# Altium project PCB_Project1.PrjPCB
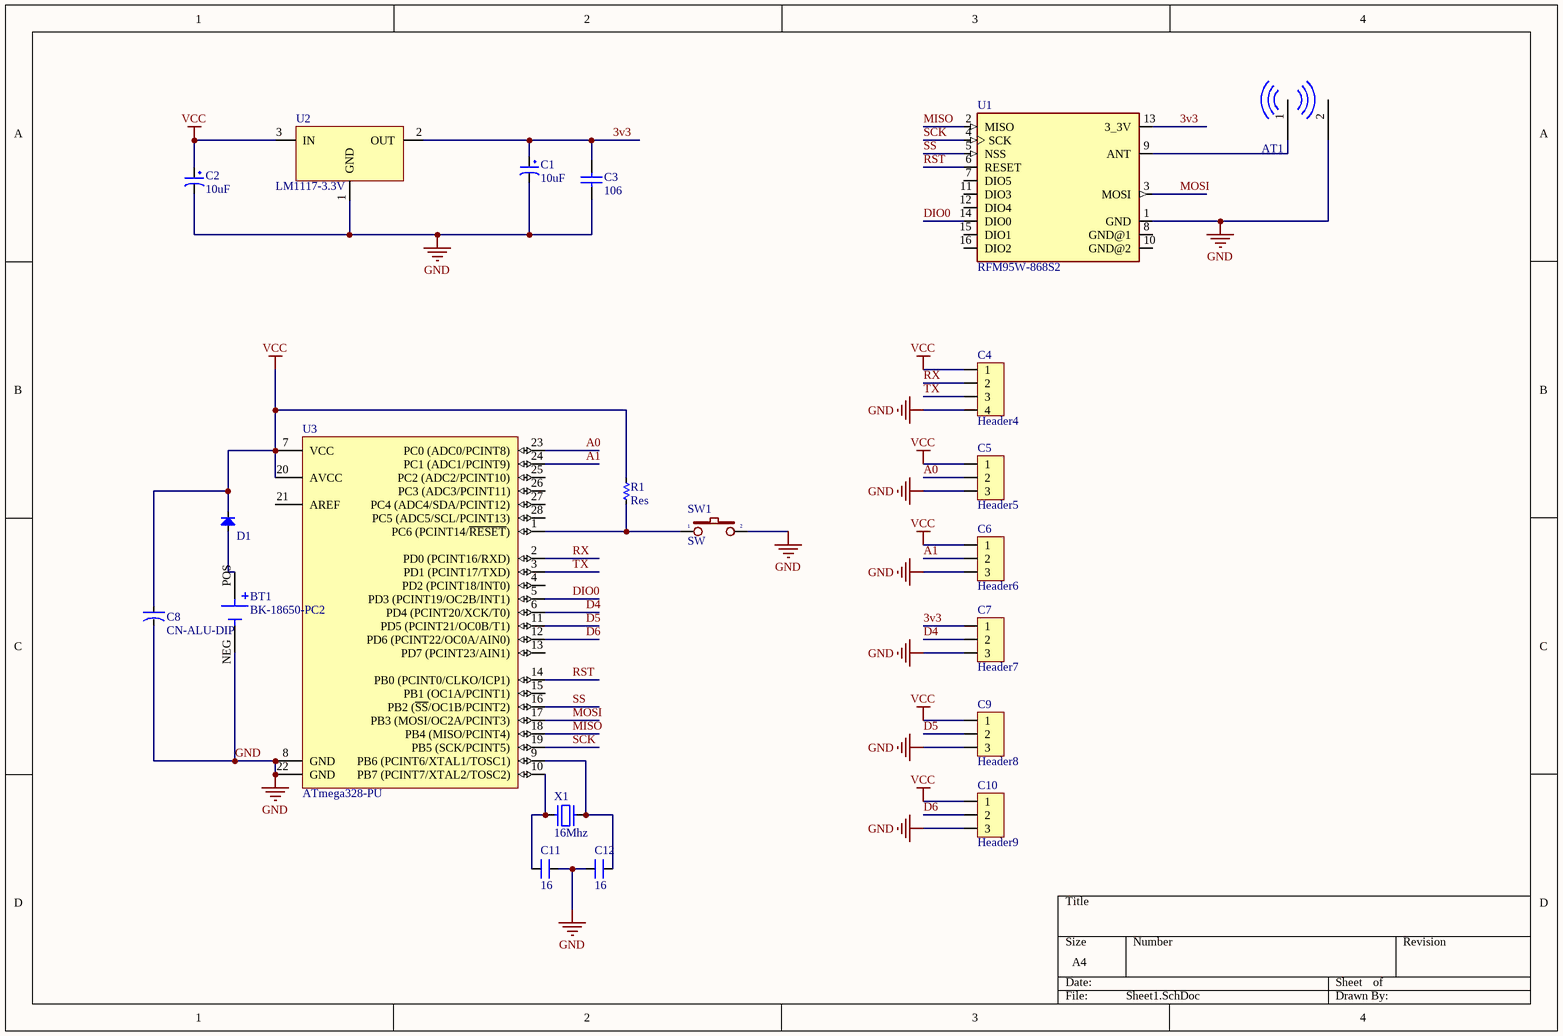
[diagram p0: Sheet1.SchDoc]
1 sheet, 21 parts. Net scope: global (net labels, ports and power ports of the same name join across sheets).
Board files: PCB1.PcbDoc, PCB2.PcbDoc

## Sheet Sheet1.SchDoc
size A4

### Parts
AT1  IPEX_CON  [U.FL/UMCC]  (value not drawn)
BT1  BK-18650-PC2  [BAT_BK-18650-PC2]
C1  10uF  [tu hoa 4mm]
C2  10uF  [tu hoa 4mm]
C3  106  [Tu 0805]
C4  Header4  [HDR4]
C5  Header5  [HDR3]
C6  Header6  [HDR3]
C7  Header7  [HDR3]
C8  CN-ALU-DIP  [CA-ALU-10BL]
C9  Header8  [HDR3]
C10  Header9  [HDR3]
C11  16  [CN1.5]
C12  16  [CN1.5]
D1  Diode  [DIO-1A]  (value not drawn)
R1  Res  [RES-1/8W]
SW1  SW  [SW1-SMD]
U1  RFM95W-868S2  [XCVR_RFM95W-868S2]
U2  LM1117-3.3V  [SOT223]
U3  ATmega328-PU  [DIP28]
X1  16Mhz  [XTAL-RU49/4]

### Nets
GND: AT1.2 BT1.NEG C1.2 C2.2 C3.2 C4.4 C5.3 C6.3 C7.3 C8.2 C9.3 C10.3 C11.2 C12.1 SW1.2 U1.1(GND) U2.1(GND) U3.8(GND) U3.22(GND)
VCC: C2.1 C4.1 C5.1 C6.1 C8.1 C9.1 C10.1 D1.2(K) R1.1 U2.3(IN) U3.7(VCC) U3.20(AVCC)
3v3: C1.1 C3.1 C7.1 U1.13(3_3V) U2.2(OUT)
A0: C5.2 U3.23(PC0_(ADC0/PCINT8))
A1: C6.2 U3.24(PC1_(ADC1/PCINT9))
D4: C7.2 U3.6(PD4_(PCINT20/XCK/T0))
D5: C9.2 U3.11(PD5_(PCINT21/OC0B/T1))
D6: C10.2 U3.12(PD6_(PCINT22/OC0A/AIN0))
DIO0: U1.14(DIO0) U3.5(PD3_(PCINT19/OC2B/INT1))
MISO: U1.2(MISO) U3.18(PB4_(MISO/PCINT4))
MOSI: U1.3(MOSI) U3.17(PB3_(MOSI/OC2A/PCINT3))
RST: U1.6(RESET) U3.14(PB0_(PCINT0/CLKO/ICP1))
RX: C4.2 U3.2(PD0_(PCINT16/RXD))
SCK: U1.4(SCK) U3.19(PB5_(SCK/PCINT5))
SS: U1.5(NSS) U3.16(PB2_(~{SS}/OC1B/PCINT2))
TX: C4.3 U3.3(PD1_(PCINT17/TXD))
NetAT1_1: AT1.1(AT) U1.9(ANT)
NetBT1_POS: BT1.POS D1.1(A)
NetC11_1: C11.1 U3.10(PB7_(PCINT7/XTAL2/TOSC2)) X1.1
NetC12_2: C12.2 U3.9(PB6_(PCINT6/XTAL1/TOSC1)) X1.2
NetR1_2: R1.2 SW1.1 U3.1(PC6_(PCINT14/~{RESET}))

Not connected (* = marked no-connect by the designer): U1 7(DIO5) 8(GND@1) 10(GND@2) 11(DIO3) 12(DIO4) 15(DIO1) 16(DIO2); U3 4(PD2_(PCINT18/INT0)) 13(PD7_(PCINT23/AIN1)) 15(PB1_(OC1A/PCINT1)) 21(AREF) 25(PC2_(ADC2/PCINT10)) 26(PC3_(ADC3/PCINT11)) 27(PC4_(ADC4/SDA/PCINT12)) 28(PC5_(ADC5/SCL/PCINT13))

### Library data of the parts
AT1 = LTI-IPXSM66AL: IPEX CONNECTER ANTENNA GPS GSM; Solder: SMT; MPN: LTI-IPXSM66AL; Value: IPEX_CON
BT1 = BK-18650-PC2: Battery Holder _Open_ 18650 1 Cell PC Pin; MF: MPD; MP: BK-18650-PC2; Availability: Unavailable; Package: None; Value: *; Price: None; SnapEDA_Link: https://www.snapeda.com/parts/BK-18650-PC2/MPD/view-part/4480461/?ref=snap
C1 C2 = Tu Hoa 10uF 25V 4x7: Cắm; So_Chan: 2; Ten_Linh_Kien: Tụ Hóa 10uF 25V 4x7MM; Don_Vi: Con; Ma_Hang: MH001349; Chung_Loai: Cắm; Kieu_Chan: *
C3 = Tu 0805 106 16V 10%: Dán; Ten_Linh_Kien: Tụ 0805 106-10uF 10% 16V; So_Chan: 2; Don_Vi: Con; Ma_Hang: MH004553; Chung_Loai: Dán; Kieu_Chan: *
C4 = Header4: Header IDC, 4 x 1 Pin Vertical 2.54mm Pitch (Non-Boxed, Male); Manufacturer: W¨¹rth Elektronik eiSos GmbH; partNo: 613002143121; ComponentLink1 Description: Manufacturer; ComponentLink2 Description: Datasheet; NoPins: 02; Created Date: 29 March 2013; ComponentLink1URL: http://www.we-online.com; ComponentLink2URL: http://katalog.we-online.de/em/datasheet/6130xx143121.pdf; Created by: Karrer Zheng
C5-C7 C9 C10 = Header3: Header IDC, 3 x 1 Pin Vertical 2.54mm Pitch (Non-Boxed, Male); Manufacturer: W¨¹rth Elektronik eiSos GmbH; partNo: 613002143121; ComponentLink1 Description: Manufacturer; ComponentLink2 Description: Datasheet; NoPins: 02; Created Date: 29 March 2013; ComponentLink1URL: http://www.we-online.com; ComponentLink2URL: http://katalog.we-online.de/em/datasheet/6130xx143121.pdf; Created by: Karrer Zheng
C8 = CN-ALU-DIP: Capacitor (Semiconductor SIM Model); Value: 104; LatestRevisionDate: 17-Jul-2002; LatestRevisionNote: Re-released for DXP Platform.; PackageReference: C1206; Publisher: Altium Limited
C11 C12 = CN1.5: Cap np 682pF => 104pF; Value: 0.01uF
D1 = Diode: Default Diode; Code - JEDEC: DO-214-AB; Value: 1N5007; Published: 8-Jun-2000; Revision: July-2002: Re-released for DXP Platform.; Publisher: Altium Limited
R1 = Res: Manufacturer: Generic Components; Class: Passive; SubClass: R; Published: 08/06/2000; Publisher: Altium Hobart Technology Centre
SW1 = SW2: Switch button 2 pin; Value: SW chip 2 pin
U1 = RFM95W-868S2: General ISM < 1GHz LoRaâ„¢ Transceiver Module 868MHz Antenna Not Included Surface Mount; MF: RF; Availability: Unavailable; Price: None; Package: SMD-16 Hope Microelectronics; MP: RFM95W-868S2; Value: *; SnapEDA_Link: https://www.snapeda.com/parts/RFM95W-868S2/RF%20Solutions/view-part/329180/?ref=snap
U2 = LM1117: 800mA Low-Dropout Linear Regulator; Creator: Nguyen Ba Bien; Website: http://group3i.net
U3 = ATmega328-PU: 8-bit AVR Microcontroller, 32KB Flash, 1KB EEPROM, 2KB SRAM, 28-pin PDIP, Industrial Grade (-40°C to 85°C); Published: 1-Apr-2010; DatasheetVersion: revA, Jan-2010; PackageVersion: revB, Sep-2001; PackageReference: 28P3; Publisher: Altium Limited; PackageDescription: 28-lead (0.300"/7.62mm Wide) Plastic Dual Inline Package (PDIP); Supplier 1: Digi-Key; Supplier Part Number 1: ATMEGA328-PU-ND; Supplier 2: Mouser; Supplier Part Number 2: 556-ATMEGA328-PU; ComponentLink1Description: Manufacturer Link; ComponentLink1URL: http://www.atmel.com/products/avr/default.asp?; ComponentLink2Description: ATmega48A/48PA/88A/88PA/168A/168PA/328/328P Datasheet; ComponentLink2URL: http://www.atmel.com/dyn/resources/prod_documents/8271.pdf; ComponentLink3Description: ATmega48A/48PA/88A/88PA/168A/168PA/328/328P Summary; ComponentLink3URL: http://www.atmel.com/dyn/resources/prod_documents/8271S.pdf; ComponentLink4Description: Atmel.com Home; ComponentLink4URL: http://www.atmel.com
X1 = XT2: Crystal, 32.768 KHz, -40 to 85 degC, 3.2 x 1.5 x 0.9 mm SMD; Value: 4Mhz